# EAGLE design Fubarino_SD_v15 (EAGLE 9.4.2)
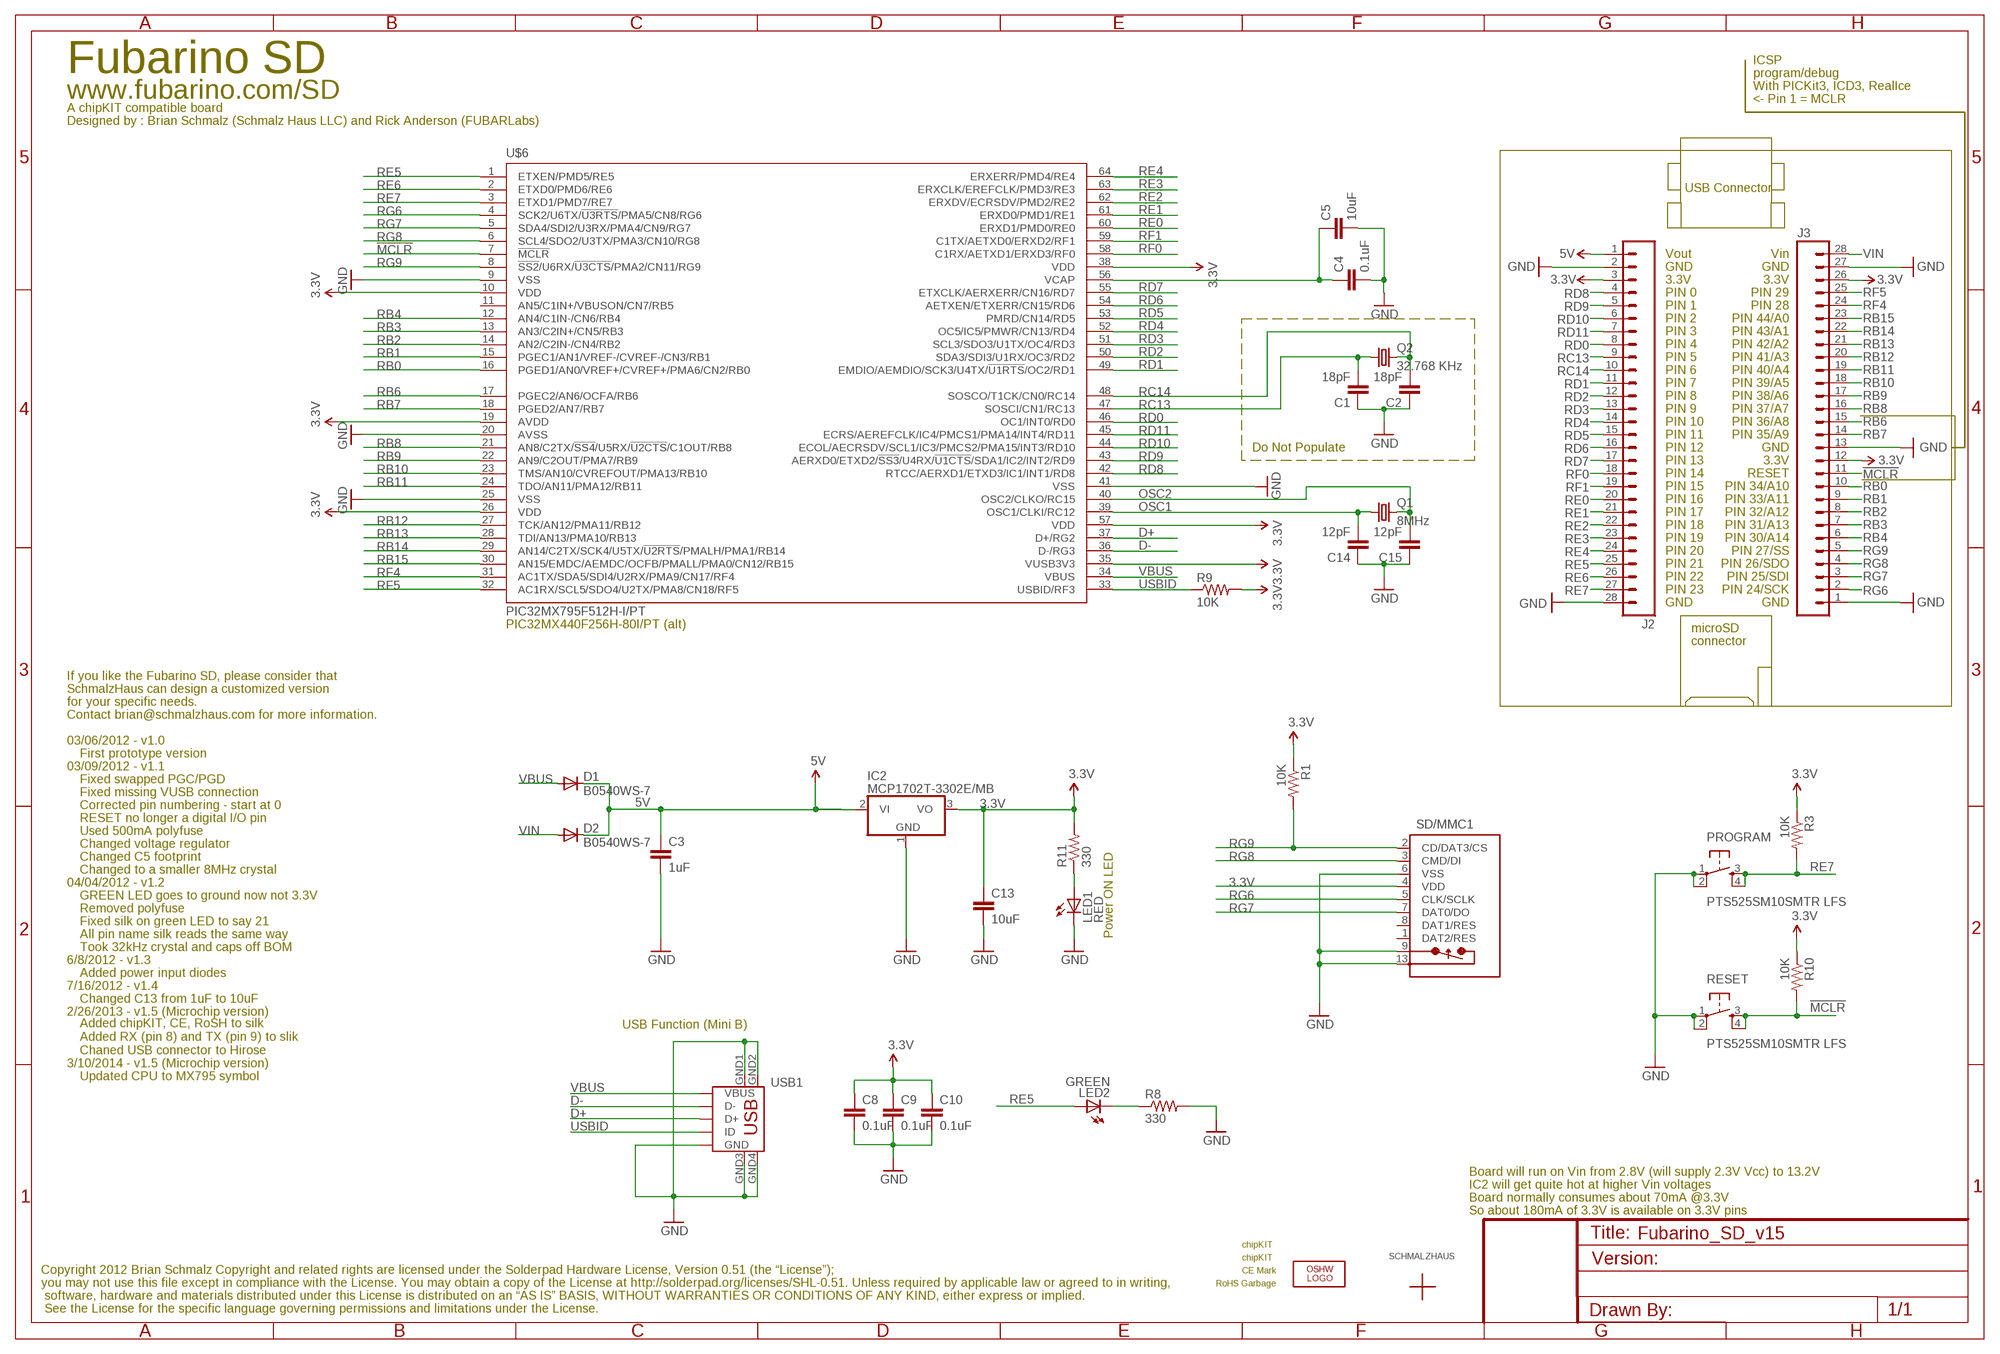
[diagram p0: schematic, sheet 1]

## Parts
C1  18pF  CAP0603-CAP  [0603-CAP]
C2  18pF  CAP0603-CAP  [0603-CAP]
C3  1uF  CAP0603-CAP  [0603-CAP]
C4  0.1uF  CAP0603-CAP  [0603-CAP]
C5  10uF  CAP0805  [0805]
C8  0.1uF  CAP0603-CAP  [0603-CAP]
C9  0.1uF  CAP0603-CAP  [0603-CAP]
C10  0.1uF  CAP0603  [0603]
C13  10uF  CAP0805  [0805]
C14  12pF  CAP0603-CAP  [0603-CAP]
C15  12pF  CAP0603-CAP  [0603-CAP]
D1  B0540WS-7  DIODESOD  [SOD-323]
D2  B0540WS-7  DIODESOD  [SOD-323]
IC2  MCP1702T-3302E/MB  MCP170333MB  [SOT89]
J2  M28USEPIN1  [1X28]
J3  M28NOPIN1  [1X28_NO_PIN_1]
LED1  RED  LED0603  [LED-0603]
LED2  GREEN  LED0603  [LED-0603]
LOGO1  OSHW_LOGO_8MILX0070-NT  [OSHW_8X70_NOTEXT]
PROGRAM  PTS525SM10SMTR LFS  TAC_SWITCHSND  [TACTILE_SWITCH_SMD]
Q1  8MHz  CRYSTALNX5032  [NX5032_5MM_3.2MM_CRYSTAL]
Q2  32.768 KHz  CRYSTALTC26H  [TC26H]
R1  10K  RESISTOR0603-RES  [0603-RES]
R3  10K  RESISTOR0603-RES  [0603-RES]
R8  330  RESISTOR0603-RES  [0603-RES]
R9  10K  RESISTOR0603-RES  [0603-RES]
R10  10K  RESISTOR0603-RES  [0603-RES]
R11  330  RESISTOR0603-RES  [0603-RES]
RESET  PTS525SM10SMTR LFS  TAC_SWITCHSND  [TACTILE_SWITCH_SMD]
SD/MMC1  MICRO_SD/MMC_CP_NEWTFC-WPAPR-08  [TFC-WPAPR-08]
U$1  SCHMALZHAUSSCHMALZHAUS_SMALL  [SCHMALZHAUS_SMALL]
U$2  CE_MARK5MM  [CE_5MM]
U$3  ROHS_GARBAGE  [ROHS_GARBAGE_5MM]
U$4  CHIPKIT2MM  [CHIPKIT_2MM]
U$5  CHIPKIT2MM  [CHIPKIT_2MM]
U$6  PIC32MX795F512H-I/PT  [TQFP64-10X10]
USB1  MINI_USB9SMALLER_CREAM  [USB_MINI_9PIN-SMALLER_CREAM]

## Nets
3.3V: C8.1 C9.1 C10.1 C13.1 IC2.3(VO) J2.3 J3.12 J3.26 R1.1 R3.1 R9.2 R10.1 R11.2 SD/MMC1.4(VDD) U$6.10(VDD) U$6.19(AVDD) U$6.26(VDD) U$6.35(VUSB3V3) U$6.38(VDD) U$6.57(VDD)
5V: C3.1 D1.1(C) D2.1(C) IC2.2(VI) IC2.2@1(VI1) J2.1
!MCLR!: J3.11 R10.2 RESET.3 RESET.4 U$6.7(!MCLR)
D+: U$6.37(D+/RG2) USB1.D+
D-: U$6.36(D-/RG3) USB1.D-
GND: C1.1 C2.1 C3.2 C4.2 C5.2 C8.2 C9.2 C10.2 C13.2 C14.1 C15.1 IC2.1(GND) J2.2 J2.28 J3.1 J3.13 J3.27 LED1.C PROGRAM.1 PROGRAM.2 R8.2 RESET.1 RESET.2 SD/MMC1.6(VSS) SD/MMC1.9(CP_E) SD/MMC1.13(PACK1) U$6.9(VSS) U$6.20(AVSS) U$6.25(VSS) U$6.41(VSS) USB1.GND USB1.GND1 USB1.GND2 USB1.GND3 USB1.GND4
N$6: LED1.A R11.1
N$20: LED2.C R8.1
N$110: C4.1 C5.1 U$6.56(VCAP)
OSC1: C14.2 Q1.1 U$6.39(OSC1/CLKI/RC12)
OSC2: C15.2 Q1.2 U$6.40(OSC2/CLKO/RC15)
RB0: J3.10 U$6.16(PGED1/AN0/VREF+/CVREF+/PMA6/CN2/RB0)
RB1: J3.9 U$6.15(PGEC1/AN1/VREF-/CVREF-/CN3/RB1)
RB2: J3.8 U$6.14(AN2/C2IN-/CN4/RB2)
RB3: J3.7 U$6.13(AN3/C2IN+/CN5/RB3)
RB4: J3.6 U$6.12(AN4/C1IN-/CN6/RB4)
RB6: J3.15 U$6.17(PGEC2/AN6/OCFA/RB6)
RB7: J3.14 U$6.18(PGED2/AN7/RB7)
RB8: J3.16 U$6.21(AN8/C2TX/!SS4!/U5RX/!U2CTS!/C1OUT/RB8)
RB9: J3.17 U$6.22(AN9/C2OUT/PMA7/RB9)
RB10: J3.18 U$6.23(TMS/AN10/CVREFOUT/PMA13/RB10)
RB11: J3.19 U$6.24(TDO/AN11/PMA12/RB11)
RB12: J3.20 U$6.27(TCK/AN12/PMA11/RB12)
RB13: J3.21 U$6.28(TDI/AN13/PMA10/RB13)
RB14: J3.22 U$6.29(AN14/C2TX/SCK4/U5TX/!U2RTS!/PMALH/PMA1/RB14)
RB15: J3.23 U$6.30(AN15/EMDC/AEMDC/OCFB/PMALL/PMA0/CN12/RB15)
RC13: C1.2 J2.9 Q2.1 U$6.47(SOSCI/CN1/RC13)
RC14: C2.2 J2.10 Q2.2 U$6.48(SOSCO/T1CK/CN0/RC14)
RD0: J2.8 U$6.46(OC1/INT0/RD0)
RD1: J2.11 U$6.49(EMDIO/AEMDIO/SCK3/U4TX/!U1RTS!/OC2/RD1)
RD2: J2.12 U$6.50(SDA3/SDI3/U1RX/OC3/RD2)
RD3: J2.13 U$6.51(SCL3/SDO3/U1TX/OC4/RD3)
RD4: J2.14 U$6.52(OC5/IC5/PMWR/CN13/RD4)
RD5: J2.15 U$6.53(PMRD/CN14/RD5)
RD6: J2.16 U$6.54(AETXEN/ETXERR/CN15/RD6)
RD7: J2.17 U$6.55(ETXCLK/AERXERR/CN16/RD7)
RD8: J2.4 U$6.42(RTCC/AERXD1/ETXD3/IC1/INT1/RD8)
RD9: J2.5 U$6.43(AERXD0/ETXD2/!SS3!/U4RX/!U1CTS!/SDA1/IC2/INT2/RD9)
RD10: J2.6 U$6.44(ECOL/AECRSDV/SCL1/IC3/PMCS2/PMA15/INT3/RD10)
RD11: J2.7 U$6.45(ECRS/AEREFCLK/IC4/PMCS1/PMA14/INT4/RD11)
RE0: J2.20 U$6.60(ERXD1/PMD0/RE0)
RE1: J2.21 U$6.61(ERXD0/PMD1/RE1)
RE2: J2.22 U$6.62(ERXDV/ECRSDV/PMD2/RE2)
RE3: J2.23 U$6.63(ERXCLK/EREFCLK/PMD3/RE3)
RE4: J2.24 U$6.64(ERXERR/PMD4/RE4)
RE5: J2.25 LED2.A U$6.1(ETXEN/PMD5/RE5)
RE6: J2.26 U$6.2(ETXD0/PMD6/RE6)
RE7: J2.27 PROGRAM.3 PROGRAM.4 R3.2 U$6.3(ETXD1/PMD7/RE7)
RF0: J2.18 U$6.58(C1RX/AETXD1/ERXD3/RF0)
RF1: J2.19 U$6.59(C1TX/AETXD0/ERXD2/RF1)
RF4: J3.24 U$6.31(AC1TX/SDA5/SDI4/U2RX/PMA9/CN17/RF4)
RF5: J3.25 U$6.32(AC1RX/SCL5/SDO4/U2TX/PMA8/CN18/RF5)
RG6: J3.2 SD/MMC1.5(CLK/SCLK) U$6.4(SCK2/U6TX/!U3RTS!/PMA5/CN8/RG6)
RG7: J3.3 SD/MMC1.7(DAT0/DO) U$6.5(SDA4/SDI2/U3RX/PMA4/CN9/RG7)
RG8: J3.4 SD/MMC1.3(CMD/DI) U$6.6(SCL4/SDO2/U3TX/PMA3/CN10/RG8)
RG9: J3.5 R1.2 SD/MMC1.2(CD/DAT3/CS) U$6.8(!SS2!/U6RX/!U3CTS!/PMA2/CN11/RG9)
USBID: R9.1 U$6.33(USBID/RF3) USB1.ID
VBUS: D1.2(A) U$6.34(VBUS) USB1.VBUS
VIN: D2.2(A) J3.28
Unconnected: SD/MMC1.1(DAT2/RES) SD/MMC1.8(DAT1/RES) U$6.11(AN5/C1IN+/VBUSON/CN7/RB5)

## Notes on the sheet
- ICSP
- Fubarino SD
- program/debug
- With PICKit3, ICD3, RealIce
- www.fubarino.com/SD
- <- Pin 1 = MCLR
- A chipKIT compatible board
- Designed by : Brian Schmalz (Schmalz Haus LLC) and Rick Anderson (FUBARLabs)
- USB Connector
- Vin
- Vout
- GND
- GND
- 3.3V
- 3.3V
- PIN 29
- PIN 0
- PIN 28
- PIN 1
- PIN 44/A0
- PIN 2
- PIN 43/A1
- PIN 3
- PIN 42/A2
- PIN 4
- PIN 41/A3
- PIN 5
- PIN 40/A4
- PIN 6
- PIN 39/A5
- PIN 7
- PIN 38/A6
- PIN 8
- PIN 37/A7
- PIN 9
- PIN 36/A8
- PIN 10
- PIN 35/A9
- PIN 11
- GND
- Do Not Populate | PIN 12
- 3.3V
- PIN 13
- RESET
- PIN 14
- PIN 34/A10
- PIN 15
- PIN 33/A11
- PIN 16
- PIN 32/A12
- PIN 17
- PIN 31/A13
- PIN 18
- PIN 30/A14
- PIN 19
- PIN 27/SS
- PIN 20
- PIN 26/SDO
- PIN 21
- PIN 25/SDI
- PIN 22
- PIN 24/SCK
- PIN 23
- GND
- GND
- PIC32MX440F256H-80I/PT (alt)
- microSD
- connector
- If you like the Fubarino SD, please consider that
- SchmalzHaus can design a customized version
- for your specific needs.
- Contact brian@schmalzhaus.com for more information.
- 03/06/2012 - v1.0
- First prototype version
- 03/09/2012 - v1.1
- Fixed swapped PGC/PGD
- Fixed missing VUSB connection
- Corrected pin numbering - start at 0
- RESET no longer a digital I/O pin
- Used 500mA polyfuse
- Changed voltage regulator
- Changed C5 footprint
- Changed to a smaller 8MHz crystal
- 04/04/2012 - v1.2
- GREEN LED goes to ground now not 3.3V
- Removed polyfuse
- Fixed silk on green LED to say 21
- All pin name silk reads the same way | Power ON LED
- Took 32kHz crystal and caps off BOM
- 6/8/2012 - v1.3
- Added power input diodes
- 7/16/2012 - v1.4
- Changed C13 from 1uF to 10uF
- 2/26/2013 - v1.5 (Microchip version)
- USB Function (Mini B)
- Added chipKIT, CE, RoSH to silk
  Added RX (pin 8) and TX (pin 9) to slik
  Chaned USB connector to Hirose
- 3/10/2014 - v1.5 (Microchip version)
- Updated CPU to MX795 symbol
- Board will run on Vin from 2.8V (will supply 2.3V Vcc) to 13.2V
- IC2 will get quite hot at higher Vin voltages
- Board normally consumes about 70mA @3.3V
- So about 180mA of 3.3V is available on 3.3V pins
- Copyright 2012 Brian Schmalz Copyright and related rights are licensed under the Solderpad Hardware License, Version 0.51 (the “License”);
- you may not use this file except in compliance with the License. You may obtain a copy of the License at http://solderpad.org/licenses/SHL-0.51. Unless required by applicable law or agreed to in writing,
- software, hardware and materials distributed under this License is distributed on an “AS IS” BASIS, WITHOUT WARRANTIES OR CONDITIONS OF ANY KIND, either express or implied.
- See the License for the specific language governing permissions and limitations under the License.

## Library data of the parts
C1-C4 C8 C9 C14 C15 = SparkFun:CAP: Capacitor Standard 0603 ceramic capacitor, and 0.1" leaded capacitor.
C5 = SchmalzHaus:CAP: Capacitor Standard 0603 ceramic capacitor, and 0.1" leaded capacitor.
C10 C13 = SparkFun02-20-08:CAP: Capacitor Standard 0603 ceramic capacitor, and 0.1" leaded capacitor.
D1 D2 = SparkFun:DIODE: Diode These are standard reverse protection diodes and small signal diodes. SMA package can handle up to about 1A. SOD-323 can handle about 200mA. What the SOD-323 package when ordering, there are some mfgs out there that are 5-pin packages.
IC2 = linear:MCP1703*: 250 mA, 16V, Low Quiescent Current LDO Regulator Source: http://ww1.microchip.com/downloads/en/DeviceDoc/22049b.pdf
J2 J3 = SchmalzHaus:M28
LED1 LED2 = SparkFun:LED: LEDs Standard schematic elements and footprints for 5mm, 3mm, 1206, and 0603 sized LEDs. 5mm - Spark Fun Electronics SKU : COM-00529 (and others)
LOGO1 = OSHW:OSHW_LOGO_8MIL
PROGRAM RESET = SparkFun02-20-08:TAC_SWITCH: Momentary Switch Button commonly used for reset or general input. Spark Fun Electronics SKU : COM-00097
Q1 Q2 = SchmalzHaus:CRYSTAL: Crystals Various standard crystals. Proven footprints. Spark Fun Electronics SKU : COM-00534
R1 R3 R8-R11 = SparkFun:RESISTOR: Resistor Basic schematic elements and footprints for 0603, 1206, and PTH resistors.
SD/MMC1 = OLIMEX_CONNECTORS:MICRO_SD/MMC_CP_NEW
U$1 = SchmalzHaus:SCHMALZHAUS
U$2 = SchmalzHausPublic:CE_MARK
U$3 = SchmalzHausPublic:ROHS_GARBAGE
U$4 U$5 = SchmalzHausPublic:CHIPKIT
U$6 = SchmalzHaus:PIC32MX795F512H
USB1 = OLIMEX_CONNECTORS:MINI_USB9

## Board
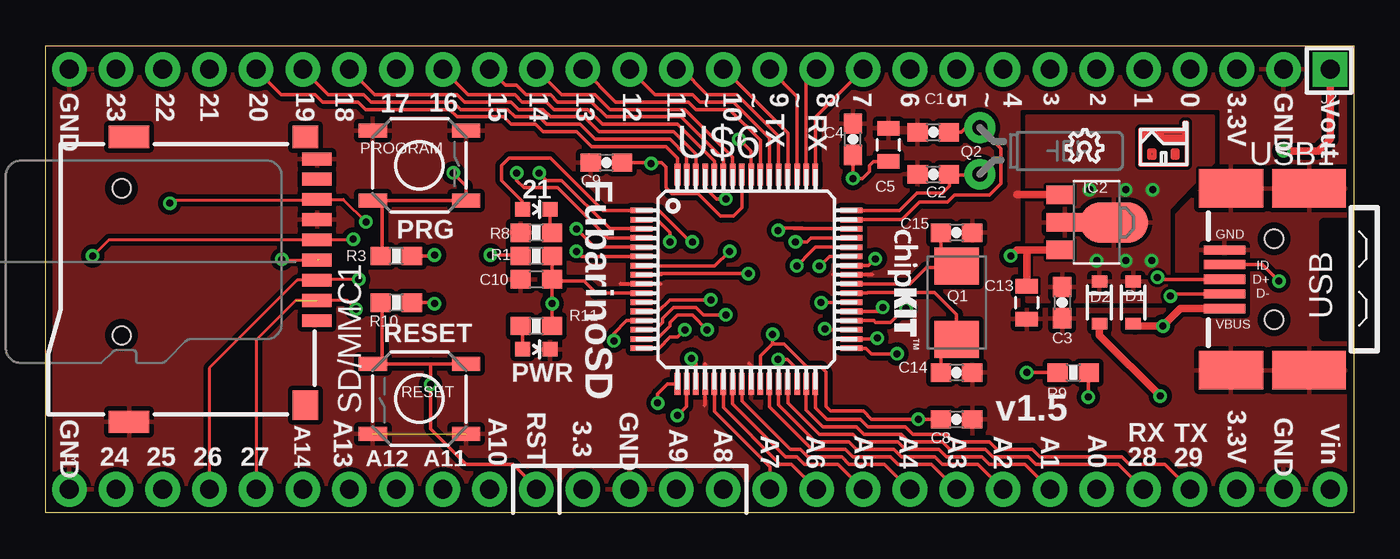
[diagram p1: board, top side]
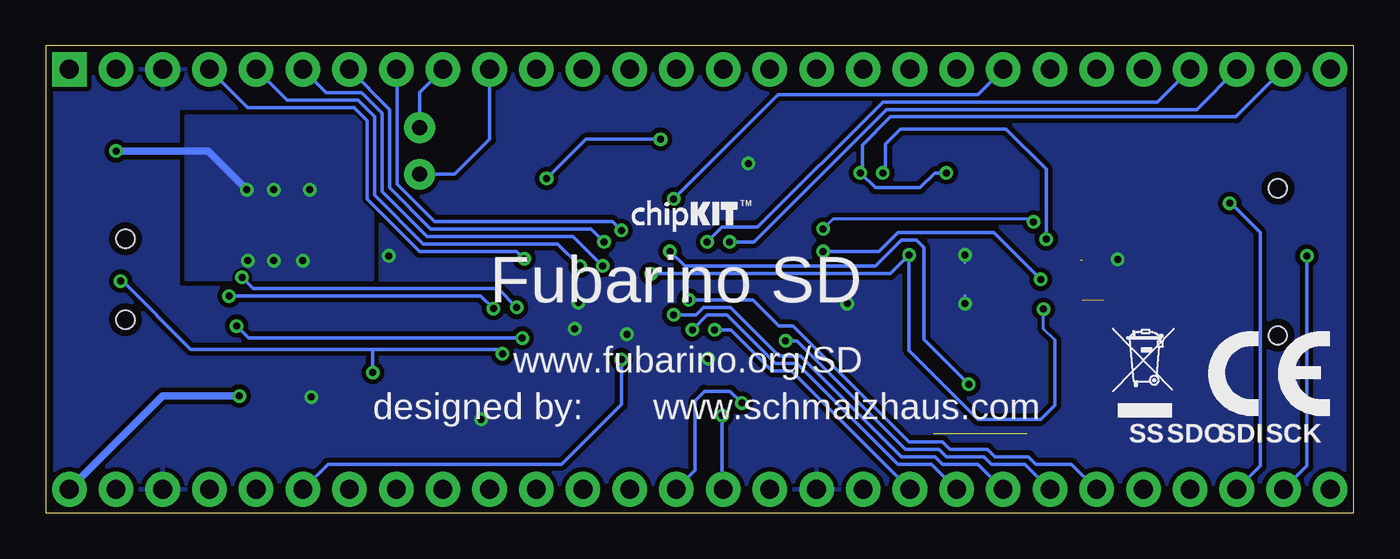
[diagram p2: board, bottom side, seen from below]

Size 71.12 x 25.4 mm. Coordinates in mm from the lower left corner, seen from the top.
Outline: 0,25.4 71.12,25.4 71.12,0 0,0 0,25.4
Copper layers (1*16): Top 0.0356mm / dielectric 1.5011mm / Bottom 0.0356mm
Design rules "LaenPCBOrder *": minimum track width 6mil, minimum drill 13mil, track to track 6mil, track to pad 6mil, pad to pad 6mil, via to via 6mil, smd to smd 6mil, copper to edge 15mil, drill to drill 6mil, minimum pad ring 7mil, minimum via ring 7mil, stop-mask expansion 4mil, vias tented up to drill 20mil, thermal gap 10mil

### Footprints (pad centres in the part's own frame; a part is rotated, then mirrored left to right if it is on the bottom)
0603-CAP = smd 1.1 x 1: 1 -0.85,0; 2 0.85,0
0805 = smd 0.8 x 1.2: 1 -0.9,0; 2 0.9,0
0603 = smd 1.1 x 1: 1 -0.85,0; 2 0.85,0
SOD-323 = smd 0.63 x 0.83: 1 -1.15,0; 2 1.15,0
SOT89 = smd 1 x 1.5: 1 -1.499,-1.981; 3 1.499,-1.981 | smd 1 x 2: 2 0,-1.727 | smd 2.2 x 3.7: 2@1 0,0.94
1X28 = drill 1.016 pad 1.88 square: 1 0,0 | drill 1.016 pad 1.88: 2 2.54,0; 3 5.08,0; 4 7.62,0; 5 10.16,0; 6 12.7,0; 7 15.24,0; 8 17.78,0; 9 20.32,0; 10 22.86,0; 11 25.4,0; 12 27.94,0; 13 30.48,0; 14 33.02,0; 15 35.56,0; 16 38.1,0; 17 40.64,0; 18 43.18,0; 19 45.72,0; 20 48.26,0; 21 50.8,0; 22 53.34,0; 23 55.88,0; 24 58.42,0; 25 60.96,0; 26 63.5,0; 27 66.04,0; 28 68.58,0
1X28_NO_PIN_1 = drill 1.016 pad 1.88: 1 0,0; 2 2.54,0; 3 5.08,0; 4 7.62,0; 5 10.16,0; 6 12.7,0; 7 15.24,0; 8 17.78,0; 9 20.32,0; 10 22.86,0; 11 25.4,0; 12 27.94,0; 13 30.48,0; 14 33.02,0; 15 35.56,0; 16 38.1,0; 17 40.64,0; 18 43.18,0; 19 45.72,0; 20 48.26,0; 21 50.8,0; 22 53.34,0; 23 55.88,0; 24 58.42,0; 25 60.96,0; 26 63.5,0; 27 66.04,0; 28 68.58,0
LED-0603 = smd 0.8 x 0.8: A 0,-0.75; C 0,0.75
TACTILE_SWITCH_SMD = smd 1.524 x 0.762: 1 -2.54,1.905; 2 2.54,1.905; 3 -2.54,-1.905; 4 2.54,-1.905
NX5032_5MM_3.2MM_CRYSTAL = smd 2 x 2.4: 1 -2,0; 2 2,0
TC26H = drill 0.813 pad 1.676: 1 -1.27,0; 2 1.27,0
0603-RES = smd 1.1 x 1: 1 -0.85,0; 2 0.85,0
TFC-WPAPR-08 = smd 1.6 x 0.7: 1 -6.994,2.25; 2 -6.994,1.15; 3 -6.994,0.05; 4 -6.994,-1.05; 5 -6.994,-2.15; 6 -6.994,-3.25; 7 -6.994,-4.35; 8 -6.994,-5.45; 9 -6.994,-6.55 | smd 1.4 x 1.2: 10 -6.369,-7.75 | smd 1.4 x 1.6: 11 -6.369,6.85 | smd 2.2 x 1.2: 12 3.231,-7.75; 13 3.231,7.75 | hole 1: 3.631,-4.95; 3.631,3.05
TQFP64-10X10 = smd 1.2 x 0.3: 1 -5.7,3.75; 2 -5.7,3.25; 3 -5.7,2.75; 4 -5.7,2.25; 5 -5.7,1.75; 6 -5.7,1.25; 7 -5.7,0.75; 8 -5.7,0.25; 9 -5.7,-0.25; 10 -5.7,-0.75; 11 -5.7,-1.25; 12 -5.7,-1.75; 13 -5.7,-2.25; 14 -5.7,-2.75; 15 -5.7,-3.25; 16 -5.7,-3.75; 33 5.7,-3.75; 34 5.7,-3.25; 35 5.7,-2.75; 36 5.7,-2.25; 37 5.7,-1.75; 38 5.7,-1.25; 39 5.7,-0.75; 40 5.7,-0.25; 41 5.7,0.25; 42 5.7,0.75; 43 5.7,1.25; 44 5.7,1.75; 45 5.7,2.25; 46 5.7,2.75; 47 5.7,3.25; 48 5.7,3.75 | smd 0.3 x 1.2: 17 -3.75,-5.7; 18 -3.25,-5.7; 19 -2.75,-5.7; 20 -2.25,-5.7; 21 -1.75,-5.7; 22 -1.25,-5.7; 23 -0.75,-5.7; 24 -0.25,-5.7; 25 0.25,-5.7; 26 0.75,-5.7; 27 1.25,-5.7; 28 1.75,-5.7; 29 2.25,-5.7; 30 2.75,-5.7; 31 3.25,-5.7; 32 3.75,-5.7; 49 3.75,5.7; 50 3.25,5.7; 51 2.75,5.7; 52 2.25,5.7; 53 1.75,5.7; 54 1.25,5.7; 55 0.75,5.7; 56 0.25,5.7; 57 -0.25,5.7; 58 -0.75,5.7; 59 -1.25,5.7; 60 -1.75,5.7; 61 -2.25,5.7; 62 -2.75,5.7; 63 -3.25,5.7; 64 -3.75,5.7
USB_MINI_9PIN-SMALLER_CREAM = smd 2.25 x 0.5: D+ -3.722,0; D- -3.722,-0.8; GND -3.722,1.6; ID -3.722,0.8; VBUS -3.722,-1.6 | smd 4 x 2.1: GND1 0.884,-4.95; GND3 0.884,4.95 | smd 3.5 x 2.1: GND2 -3.366,-4.95; GND4 -3.366,4.95 | hole 1: -1.016,-2.2; -1.016,2.2

### Placement (x,y rotation side)
C1  48.26,20.7 0 top
C2  48.26,18.41 0 top
C3  55.27,11.43 270 top
C4  43.89,20.32 90 top
C5  45.82,20.02 90 top
C8  49.53,5.08 0 top
C9  30.48,19.05 180 top
C10  26.67,12.7 180 top
C13  53.34,11.43 270 top
C14  49.53,7.62 180 top
C15  49.53,15.24 180 top
D1  59.13,11.43 270 top
D2  57.3,11.43 270 top
DRILEGEND  [DRILEGEND]  101.36,40.13 0 top  (outside the outline)
IC2  57.15,15.8 270 top
J2  69.85,24.13 180 top
J3  1.27,1.27 0 top
LED1  26.67,8.89 270 top
LED2  26.67,16.51 270 top
LOGO1  55.5,19.08 0 top
PROGRAM  20.32,18.9 0 top
Q1  49.53,11.43 90 top
Q2  50.8,19.68 270 top
R1  26.67,13.97 180 top
R3  19.05,13.97 180 top
R8  26.67,15.24 180 top
R9  55.88,7.62 0 top
R10  19.05,11.43 180 top
R11  26.67,10.16 0 top
RESET  20.32,6.2 180 top
SD/MMC1  7.75,12.7 180 top
U$1  60.78,18.95 0 top
U$2  4.57,7.62 0 bottom
U$3  13.08,5.21 0 bottom
U$4  45.72,15.49 270 top
U$5  39.37,15.24 0 bottom
U$6  38.1,12.7 0 top
USB1  67.82,12.7 0 top

### Tracks (layer width: path | path; a pad name or v marks a point on that pad's centre or on a via)
3.3V  (via drill 0.38)  (1 unrouted)
  Top 0.152: 14.87,13.75 12.95,13.75 12.91,13.79 v12.83,13.79
  Top 0.203: 27.62,12.6 29.26,12.6 29.91,11.95 U$6.10 | 27.62,12.6 27.62,12.59 | R3.1 21.08,13.97 v21.13,14.02 | R10.1 21.08,11.43 v21.13,11.38 | 39.52,9.2 38.86,8.53 38.86,7 U$6.26 | 39.52,9.2 40.13,9.2 41.4,7.92 42.16,7.92 42.42,7.67 42.42,5.79 42.67,5.54 44.45,5.54 44.91,5.08 v47.45,5.08 C8.1 | C10.1 R1.1 | C10.1 27.62,12.6 | C10.1 27.53,12.69 v27.53,11.38 27.52,11.37 R11.2 | C9.1 31.38,19.1 | C9.1 33.48,19.05 33.73,18.8 33.73,17.68 34.04,17.37 35.46,17.37 36.68,16.15 37.39,16.15 37.85,16.62 U$6.57 | C9.1 32.87,19.05 v32.92,19 | v56.69,6.3 56.69,7.58 R9.2 | U$6.19 35.35,8.13 v35.1,8.38 | U$6.35 42.42,9.95 v42.37,10.01 | U$6.38 42.18,11.45 v42.16,11.43 | 39.52,9.2 v39.52,9.7
  Top 0.406: IC2.3 53.34,14.3 | 53.34,14.3 52.81,14.3 v52.48,13.97 | C13.1 53.34,14.3
  Bottom 0.203: v21.13,14.02 21.13,13.61 | v21.13,11.38 21.13,11.79 | 35.41,8.31 35.56,8.46 | v42.37,10.01 42.19,10.01 42.06,10.13 | v42.16,11.43 41.94,11.43 41.88,11.38 | v39.52,9.7 39.52,9.88 39.62,9.98
  pour Bottom (isolate 0.254, rank 3): 0,0 0,25.4 71.12,25.4 71.12,0
5V  (via drill 0.38)
  Top 0.406: v67.31,19.68 69.22,19.68 69.85,20.32 J2.1
  Bottom 0.406: v67.31,19.68 62.31,19.68 v60.2,17.58
  other vias: 56.77,17.58 57.15,13.72 58.72,13.72 58.72,17.58 60.15,13.72
  pour Top: 63.5,21.59 53.34,21.59 53.34,11.48 61.06,11.48 61.06,16.51 63.5,19.05
  pour Bottom: 53.34,21.59 53.34,12.7 63.5,12.7 63.5,21.59
!MCLR!  (via drill 0.38)
  Top 0.203: v37.19,14.22 36.37,13.41 33.22,13.41 33.18,13.45 U$6.7 | J3.11 26.67,1.37 25.4,2.64 22.86,2.64 20.93,4.57 v20.93,6.99 20.93,8.1 | RESET.4 18.29,8.1 | 18.29,8.1 20.93,8.1 | 20.93,8.1 RESET.3 | R10.2 18.29,11.43 18.29,8.1
  Bottom 0.203: v37.19,14.22 36.37,13.41 26.01,13.41 24.59,14.83 23.77,14.83 23.37,14.43 23.37,9.42 v20.93,6.99
D+  (via drill 0.38)
  Top 0.203: v60.45,12.8 60.55,12.7 USB1.D+ | U$6.37 45.29,10.95 v45.52,11.18
  Bottom 0.203: v60.45,12.8 59.84,12.19 46.53,12.19 v45.52,11.18
D-  (via drill 0.38)
  Top 0.203: v46.79,11.1 46.66,11.1 45.92,10.36 45.11,10.36 45.02,10.45 U$6.36 | v61.16,11.79 61.28,11.9 USB1.D-
  Bottom 0.203: v61.16,11.79 47.47,11.79 v46.79,11.1
GND  (1 unrouted)
  Top 0.152: USB1.GND3 67.57,17.65 67.31,17.91 67.69,18.29 67.94,18.29 68.07,18.16 67.82,17.91
  Top 0.203: 44.96,12.95 44.95,12.95 U$6.41 42.8,12.95 | U$6.25 38.35,8.01 38.23,8.13 | 35.87,8.08 35.85,8.09 U$6.20 35.85,5.88 35.81,5.84 | 31.24,12.47 31.26,12.45 U$6.9 33.45,12.45
  Top 0.406: 52.81,17.3 IC2.1
  pour Top (isolate 0.254, rank 4): 0,25.4 0,0 71.12,0 71.12,25.4
N$6
  Top 0.203: 25.82,10.06 R11.1 25.92,10.06 LED1.A
N$20
  Top 0.203: LED2.C 27.42,15.34 R8.1
N$110  (via drill 0.38)
  Top 0.203: v37.69,20.32 38.35,19.66 U$6.56 | C4.1 v43.89,18.19 44.4,18.19 44.78,18.57 44.78,18.9 45,19.11 C5.1
  Bottom 0.203: v37.69,20.32 41.76,20.32 v43.89,18.19
OSC1
  Top 0.203: C14.2 48.68,8.58 Q1.1 49.53,10.79 48.34,11.99 44.7,11.99 44.66,11.95 U$6.39
OSC2
  Top 0.203: 48.9,13.34 47.88,13.34 46.99,12.45 U$6.40 | 48.9,13.34 49.44,13.34 Q1.2 | C15.2 48.68,13.55 48.9,13.34
RB0  (via drill 0.38)
  Top 0.203: v34.75,9.96 34.35,9.56 33.94,9.56 33.33,8.95 U$6.16
  Bottom 0.203: J3.10 30.58,7.72 31.62,7.72 33.86,9.96 v34.75,9.96
RB1  (via drill 0.38)
  Top 0.203: v35.97,9.96 35.15,10.77 34.34,10.77 33.93,10.36 33.93,10.16 33.22,9.45 U$6.15
  Bottom 0.203: v35.97,9.96 35.15,10.77 34.09,10.77 31.45,8.13 30.28,8.13 24.79,2.64 22.96,2.64 J3.9
RB2  (via drill 0.38)
  Top 0.203: v36.98,10.77 35.76,10.77 35.36,11.18 34.14,11.18 33.53,10.57 33.53,10.36 33.12,9.95 U$6.14
  Bottom 0.203: v36.98,10.77 35.76,10.77 35.36,11.18 33.88,11.18 31.24,8.53 30.07,8.53 24.59,3.05 22.76,3.05 22.35,2.64 20.42,2.64 J3.8
RB3  (via drill 0.38)
  Top 0.203: v30.89,9.35 30.89,9.75 31.58,10.45 U$6.13
  Bottom 0.203: J3.7 17.88,2.64 19.71,2.64 20.12,3.05 22.15,3.05 22.55,3.45 24.38,3.45 30.28,9.35 v30.89,9.35
RB4  (via drill 0.38)
  Top 0.203: v36.17,11.58 33.93,11.58 33.3,10.95 U$6.12
  Bottom 0.203: v36.17,11.58 32.66,11.58 31.24,10.16 30.48,10.16 24.18,3.86 22.35,3.86 21.95,3.45 19.91,3.45 19.51,3.05 17.68,3.05 17.27,2.64 15.34,2.64 J3.6
RB6  (via drill 0.38)
  Top 0.203: v33.27,5.97 33.27,6.48 33.8,7 U$6.17
  Bottom 0.203: J3.15 36.83,1.29 35.81,2.31 35.81,6.1 35.31,6.6 33.91,6.6 v33.27,5.97
RB7  (via drill 0.38)
  Top 0.203: v34.34,5.28 34.85,5.79 U$6.18
  Bottom 0.203: v34.34,5.28 34.34,1.32 J3.14
RB8
  Top 0.203: J3.16 39.37,2.49 36.35,5.51 U$6.21
RB9
  Top 0.203: J3.17 40.54,2.64 39.93,2.64 36.85,5.72 U$6.22
RB10
  Top 0.203: J3.18 43.08,2.64 41.25,2.64 40.84,3.05 40.23,3.05 37.35,5.93 U$6.23
RB11
  Top 0.203: J3.19 45.62,2.64 43.69,2.64 43.28,3.05 41.45,3.05 41.05,3.45 40.49,3.45 37.85,6.09 U$6.24
RB12
  Top 0.203: J3.20 48.16,2.64 46.33,2.64 45.92,3.05 43.89,3.05 43.48,3.45 41.66,3.45 39.35,5.76 U$6.27
RB13
  Top 0.203: J3.21 50.7,2.64 48.77,2.64 48.36,3.05 46.53,3.05 46.13,3.45 44.09,3.45 43.69,3.86 41.86,3.86 39.85,5.87 U$6.28
RB14
  Top 0.203: J3.22 53.24,2.64 51.31,2.64 50.9,3.05 48.97,3.05 48.56,3.45 46.74,3.45 46.33,3.86 44.3,3.86 43.89,4.27 42.06,4.27 40.35,5.98 U$6.29
RB15  (via drill 0.38)
  Top 0.203: v39.83,8.33 40.34,8.33 40.85,7.82 U$6.30
  Bottom 0.203: v39.83,8.33 39.83,5.89 43.08,2.64 55.78,2.64 J3.23
RC13
  Top 0.203: C1.2 49.78,20.7 50.04,20.95 Q2.1 51.94,19.81 51.94,17.91 51.31,17.27 49.4,17.27 49.02,16.89 47.5,16.89 46.56,15.95 U$6.47
  Bottom 0.203: Q2.1 50.8,22.86 J2.9
RC14
  Top 0.203: 49.15,18.38 49.15,17.78 48.77,17.4 47.37,17.4 46.42,16.45 U$6.48 | 49.15,18.38 C2.2 | 49.15,18.38 50.76,18.38 Q2.2
  Bottom 0.203: Q2.2 48.9,18.41 46.99,20.32 J2.10
RD0  (via drill 0.38)
  Top 0.203: 41.19,15.45 41.15,15.49 40.64,15.49 | 40.64,15.49 39.95,15.49 v39.83,15.37 | U$6.46 40.68,15.45 40.64,15.49
  Bottom 0.203: J2.8 52.02,24.08 52.02,17.88 49.99,15.85 40.31,15.85 v39.83,15.37
RD1
  Top 0.203: J2.11 41.85,21.53 U$6.49
RD2
  Top 0.203: J2.12 41.35,23.57 U$6.50
RD3
  Top 0.203: J2.13 40.85,22.65 U$6.51
RD4
  Top 0.203: J2.14 36.88,24.08 36.93,24.08 40.35,20.66 U$6.52
RD5
  Top 0.203: J2.15 34.24,24.18 34.54,24.18 35.97,22.76 37.59,22.76 39.85,20.5 U$6.53
RD6
  Top 0.203: J2.16 33.12,22.76 35.15,22.76 35.56,22.35 37.39,22.35 39.35,20.39 U$6.54
RD7
  Top 0.203: J2.17 30.99,22.35 34.95,22.35 35.36,21.95 37.19,21.95 38.85,20.28 U$6.55
RD8  (via drill 0.38)
  Top 0.203: v45.11,13.82 44.74,13.45 U$6.42
  Bottom 0.203: v45.11,13.82 45.52,14.22 50.8,14.22 53.65,17.07 53.65,21.34 54.36,22.05 60.15,22.05 J2.4
RD9  (via drill 0.38)
  Top 0.203: U$6.43 42.6,13.95 v42.06,13.41
  Bottom 0.203: J2.5 58.01,22.45 54.15,22.45 53.24,21.54 53.24,17.27 50.6,14.63 43.28,14.63 v42.06,13.41
RD10  (via drill 0.38)
  Top 0.203: v40.84,13.44 41.64,14.24 41.86,14.45 U$6.44
  Bottom 0.203: 57.1,24.08 J2.6 55.88,22.86 53.95,22.86 52.83,21.74 52.83,17.48 50.39,15.04 42.44,15.04 v40.84,13.44
RD11  (via drill 0.38)
  Top 0.203: v40.77,14.73 41.4,14.73 41.62,14.95 U$6.45
  Bottom 0.203: J2.7 52.43,21.95 52.43,17.68 50.19,15.44 41.48,15.44 v40.77,14.73
RE0
  Top 0.203: J2.20 22.96,22.76 25.5,22.76 25.91,22.35 27.23,22.35 27.64,21.95 29.46,21.95 30.28,21.13 34.34,21.13 36.35,19.12 U$6.60
RE1  (via drill 0.38)
  Top 0.203: v36.98,17.07 36.47,17.07 35.85,17.69 U$6.61
  Bottom 0.203: v36.98,17.07 31.29,22.76 20.42,22.76 J2.21
RE2
  Top 0.203: J2.22 17.88,22.76 22.35,22.76 22.76,22.35 25.3,22.35 25.7,21.95 27.03,21.95 27.43,21.54 29.26,21.54 30.07,20.73 34.14,20.73 35.35,19.51 U$6.62
RE3
  Top 0.203: J2.23 15.34,22.76 17.27,22.76 17.68,22.35 22.15,22.35 22.55,21.95 25.09,21.95 25.5,21.54 26.82,21.54 27.23,21.13 29.06,21.13 29.87,20.32 33.93,20.32 34.85,19.4 U$6.63
RE4
  Top 0.203: J2.24 12.8,22.76 14.63,22.76 15.04,22.35 16.97,22.35 17.37,21.95 21.95,21.95 22.35,21.54 24.89,21.54 25.3,21.13 26.62,21.13 27.03,20.73 28.85,20.73 29.67,19.91 33.73,19.91 34.35,19.3 U$6.64
RE5  (via drill 0.38)
  Top 0.203: v35.15,14.73 35.05,14.73 33.33,16.45 U$6.1 30.29,16.45 27.43,19.3 25.2,19.3 24.79,18.9 24.79,18.09 25.91,16.97 25.91,16.52 LED2.A
  Bottom 0.203: v35.15,14.73 34.34,15.54 32.41,15.54 25.6,22.35 10.67,22.35 J2.25
RE6  (via drill 0.38)
  Top 0.203: v33.93,14.73 33.93,15.24 33.22,15.95 U$6.2
  Bottom 0.203: v33.93,14.73 32.61,14.73 25.4,21.95 8.53,21.95 J2.26
RE7  (via drill 0.38)
  Top 0.203: 18.29,16.99 PROGRAM.4 22.86,17.78 v22.15,18.49 | 18.29,16.99 PROGRAM.3 | v26.82,18.49 27.23,18.09 28.04,18.09 30.68,15.45 U$6.3 | R3.2 18.29,13.97 18.29,16.99
  Bottom 0.203: v22.15,18.49 22.76,18.49 23.57,17.68 26.01,17.68 v26.82,18.49 26.72,18.59 26.72,20.02 25.2,21.54 6.4,21.54 J2.27
RF0
  Top 0.203: J2.18 28.04,22.76 29.87,22.76 30.68,21.95 34.75,21.95 37.24,19.46 37.35,19.34 U$6.58
RF1
  Top 0.203: J2.19 24.99,23.27 25.6,23.27 26.11,22.76 27.43,22.76 27.84,22.35 29.67,22.35 30.48,21.54 34.54,21.54 36.85,19.23 U$6.59
RF4
  Top 0.203: J3.24 58.32,2.64 53.85,2.64 53.44,3.05 51.51,3.05 51.1,3.45 49.17,3.45 48.77,3.86 46.94,3.86 46.53,4.27 44.5,4.27 44.09,4.67 42.27,4.67 41.35,5.59 U$6.31
RF5
  Top 0.203: J3.25 60.86,2.64 58.93,2.64 58.52,3.05 54.05,3.05 53.65,3.45 51.71,3.45 51.31,3.86 49.38,3.86 48.97,4.27 47.14,4.27 46.74,4.67 44.7,4.67 44.3,5.08 42.47,5.08 41.85,5.7 U$6.32
RG6  (via drill 0.38)
  Top 0.152: v2.54,13.97 3.42,14.85 14.61,14.85 SD/MMC1.5 16.68,14.85 v16.71,14.88
  Top 0.203: v25.6,18.49 25.6,18.09 26.01,17.68 27.84,17.68 30.57,14.95 U$6.4
  Bottom 0.203: v16.71,14.88 16.71,18.69 18.9,20.88 24.64,20.88 25.45,20.07 25.45,18.64 v25.6,18.49 | v2.54,13.97 2.54,2.54 J3.2
RG7  (via drill 0.38)
  Top 0.152: v17.4,15.82 16.17,17.05 14.87,17.05 14.81,16.99 14.68,16.99 | v6.73,16.84 6.89,16.99 14.68,16.99 | SD/MMC1.7 14.68,16.99
  Top 0.203: v28.85,15.44 29.85,14.45 U$6.5
  Bottom 0.152: v28.85,15.44 28.3,16 17.58,16 v17.4,15.82
  Bottom 0.203: 28.65,15.65 v28.85,15.44 | J3.3 5.08,2.54 5.08,15.24 6.68,16.84 v6.73,16.84
RG8  (via drill 0.38)
  Top 0.152: 16.97,12.65 v17.02,12.7 14.79,12.7 SD/MMC1.3 | J3.4 8.89,7.87 13.67,12.65 SD/MMC1.3 | 14.87,12.65 SD/MMC1.3
  Top 0.203: v17.02,12.7 v17.01,12.69 | U$6.6 29.13,13.95 v28.85,14.22
  Bottom 0.203: v28.85,14.22 25.81,14.22 24.79,15.24 19.56,15.24 v17.02,12.7
RG9  (via drill 0.38)  (1 unrouted)
  Top 0.152: v16.87,11.07 16.39,11.55 13.58,11.55 11.43,9.4 J3.5
  Top 0.203: 33.27,12.95 33.33,13.01 33.53,13.01 | v38.2,13.01 33.53,13.01 | v24.18,14.02 25.77,14.02 R1.2 | v16.87,11.07 16.86,11.08 | U$6.8 33.47,12.95 33.53,13.01
  Bottom 0.152: v16.87,11.07 16.87,10.01 16.26,9.4
  Bottom 0.203: v38.2,13.01 25.2,13.01 v24.18,14.02 24.18,8.84 20.42,5.08 17.02,5.08 16.26,5.84 16.26,9.4
USBID  (via drill 0.38)
  Top 0.203: v67.06,12.6 66.15,13.5 USB1.ID | v46.29,8.65 46.28,8.64 44.91,8.64 44.59,8.95 U$6.33 | v53.34,7.62 R9.1
  Bottom 0.203: v67.06,12.6 66.95,12.6 63.25,8.89 53.34,8.89 | 53.34,8.89 46.53,8.89 v46.29,8.65 | v53.34,7.62 53.34,8.89
VBUS  (via drill 0.38)
  Top 0.203: 59.25,10.16 D1.2 | U$6.34 45.16,9.45 v45.21,9.5
  Top 0.406: 59.25,10.16 v60.76,10.16 61.7,11.1 USB1.VBUS
  Bottom 0.203: v60.76,10.16 60.1,9.5 v45.21,9.5
VIN  (via drill 0.38)
  Top 0.406: D2.2 57.3,9.65 v60.6,6.35
  Bottom 0.406: v60.6,6.35 64.77,6.35 J3.28

### Text on the board
tPlace: GND | 23 | 22 | 21 | 20 | 19 | 18 | 15 | 14 | 13 | 12 | 11 | ~ | 10 | ~ | 9 | ~ | 8 | ~ | 7 | 6 | 5 | ~ | 4 | 3 | 2 | 1 | 0 | 3.3V | GND | 17 | 16 | TX | RX | Vout | FubarinoSD | 21 | PRG | RESET | PWR | RST | 3.3V | GND | A14 | A13 | A10 | 3.3 | GND | A9 | A8 | v1.5 | GND | Vin | A7 | A6 | A5 | A4 | A3 | A2 | A1 | A0 | RX | TX | 24 | 25 | 26 | 27 | A12 | A11 | 28 | 29
bPlace: Fubarino SD | www.fubarino.org/SD | www.schmalzhaus.com | designed by: | SCK | SDI | SDO | SS
tDocu: ASSEMBLY NOTES: UNLESS OTHERWISE SPECIFIED / 1. ALL COMONENTS ARE RoHS COMPLIANT. / 2. ALL THROUGH HOLE COMPONENTS MOUNTED ON THE TOP SIDE / 3. ALL COMPONENTS AHLL BE MOUNTED FLUSH TO THE BOARD / 4. ALL UNUSED COMPONENTS PADS SHALL BE FREE OF SOLDER / 5. ALL LEADS SHALL BE TRIMMED TO A MAXIMUM LENGTH OF : N/A / 6. MAXIMUM COMPONENT HEIGHT NOT TO EXEED: N/A / 7. THESE COMPONENTS REQUIRE SOCKETS: NONE. / 8. UNPOPULATED COMPONENTS: SEE BILL OF MATERIALS / 9. FINISHED BOARD SHALL BE FREE FO ALL RESIDUES | TITLE: FUBARINO SD / VERSION: 1.5 / DATE: 2/27/2013 / PCB DESIGNER: BRIAN SCHMALZ / ENGINEER: BRIAN SCHMALZ
tMap: Copyright 2012 Brian Schmalz Copyright and related rights are licensed under the Solderpad Hardware License, Version 0.51 (the “License”); | you may not use this file except in compliance with the License. You may obtain a copy of the License at http://solderpad.org/licenses/SHL-0.51. Unless required by applicable law or agreed to in writing, | software, hardware and materials distributed under this License is distributed on an “AS IS” BASIS, WITHOUT WARRANTIES OR CONDITIONS OF ANY KIND, either express or implied. | See the License for the specific language governing permissions and limitations under the License.
DrillLegend: LAYER-STACK
DrillLegend_01-16: 01-16
DrillLegend_01-20: 01-20
Contour: Notes: / This PCB to be manufactued to meet all acceptance levels / of a CLASS 2 PCB per ANSI/IPC-A-600G. / Material: Isola PCL370HR FR-4 or equivalent. / Multilayer / 2 Layers / Controlled Impedance / Cu weight external layers : 1oz / Cu weight internal layers : / Finished overall thickenss : 0.062 / Finish: / Immersion Gold / X Immersion Tin / Soldermask over bare copper (SMOBC) with / Hot-Air-Leveled-Solder / If edge connector fingers are present, plate / with Nicel/Gold >= 20 microinches Gold / / Soldermask: Dynachem EPIC 200 LPI or equivalent. / Soldermask Color: Green / Silkscreen Color: White / / Artwork Set No. 05-10133 Rev 1.5 / / All holes to be located by the NC Drill File. / Indicate Country where PCB was fabricated on the / side indicated. / Any devication from the above specs must be approved / by Schmalz Haus LLC.